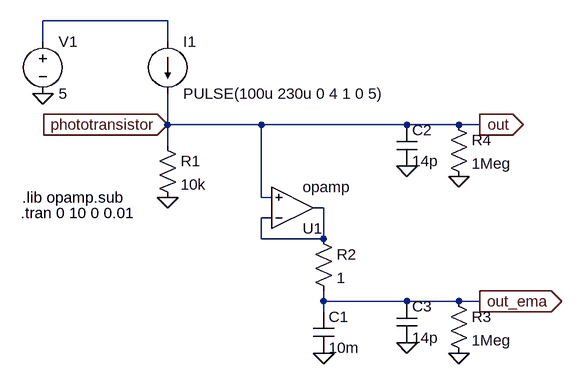
[diagram p0: schematic LightDetector (OpAmp).asc]
LightDetector (OpAmp).asc, the LTspice schematic file:
Version 4
SHEET 1 880 680
WIRE 224 48 32 48
WIRE 32 80 32 48
WIRE 224 80 224 48
WIRE 224 208 224 160
WIRE 368 208 224 208
WIRE 592 208 368 208
WIRE 672 208 592 208
WIRE 704 208 672 208
WIRE 224 240 224 208
WIRE 368 320 368 208
WIRE 384 320 368 320
WIRE 464 336 448 336
WIRE 384 352 368 352
WIRE 368 384 368 352
WIRE 464 384 464 336
WIRE 464 384 368 384
WIRE 464 480 464 464
WIRE 592 480 464 480
WIRE 672 480 592 480
WIRE 704 480 672 480
WIRE 464 496 464 480
FLAG 32 160 0
FLAG 224 320 0
FLAG 224 208 phototransistor
IOPIN 224 208 In
FLAG 464 560 0
FLAG 592 272 0
FLAG 592 544 0
FLAG 672 288 0
FLAG 672 560 0
FLAG 704 480 out_ema
IOPIN 704 480 Out
FLAG 704 208 out
IOPIN 704 208 Out
SYMBOL voltage 32 64 R0
WINDOW 123 0 0 Left 0
WINDOW 39 0 0 Left 0
SYMATTR InstName V1
SYMATTR Value 5
SYMBOL current 224 80 R0
WINDOW 123 0 0 Left 0
WINDOW 39 0 0 Left 0
SYMATTR InstName I1
SYMATTR Value PULSE(100u 230u 0 4 1 0 5)
SYMBOL res 208 224 R0
SYMATTR InstName R1
SYMATTR Value 10k
SYMBOL cap 448 496 R0
SYMATTR InstName C1
SYMATTR Value 10m
SYMBOL res 656 464 R0
SYMATTR InstName R3
SYMATTR Value 1Meg
SYMBOL res 656 192 R0
SYMATTR InstName R4
SYMATTR Value 1Meg
SYMBOL cap 576 208 R0
SYMATTR InstName C2
SYMATTR Value 14p
SYMBOL cap 576 480 R0
SYMATTR InstName C3
SYMATTR Value 14p
SYMBOL Opamps\\opamp 416 400 M180
SYMATTR InstName U1
SYMBOL res 448 368 R0
SYMATTR InstName R2
SYMATTR Value 1
TEXT -2 344 Left 2 !.tran 0 10 0 0.01
TEXT 0 320 Left 2 !.lib opamp.sub

The netlist it stands for:
* LightDetector (OpAmp).asc
V1 N001 0 5
I1 N001 out PULSE(100u 230u 0 4 1 0 5)
R1 out 0 10k
C1 out_ema 0 10m
R3 out_ema 0 1Meg
R4 out 0 1Meg
C2 out 0 14p
C3 out_ema 0 14p
XU1 N002 out N002 opamp Aol=100K GBW=10Meg  ; pins invin noninvin out
R2 N002 out_ema 1
.tran 0 10 0 0.01
.lib opamp.sub
.backanno
.end